# EAGLE design TIA sep amp 7 March (EAGLE 6.6.0)
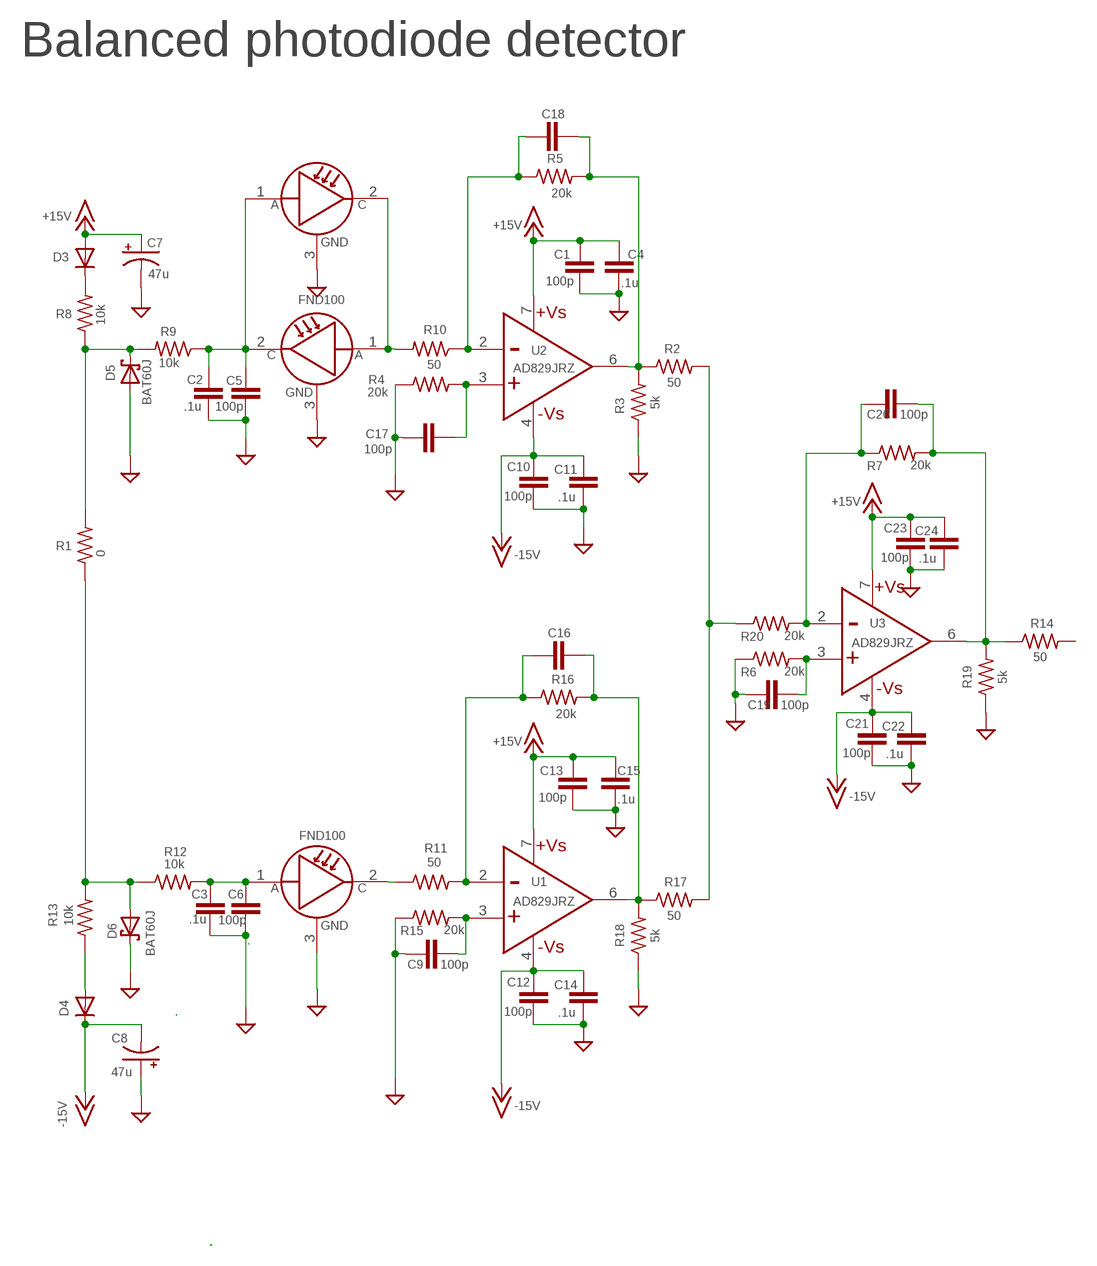
[diagram p0: schematic, sheet 1]

## Parts
C1  100p  C-EUC0603  [C0603]
C2  .1u  C-EUC0603  [C0603]
C3  .1u  C-EUC0603  [C0603]
C4  .1u  C-EUC0603  [C0603]
C5  100p  C-EUC0603  [C0603]
C6  100p  C-EUC0603  [C0603]
C7  47u  CPOL-USETR3  [ETR3]
C8  47u  CPOL-USETR3  [ETR3]
C9  100p  C-EUC0603  [C0603]
C10  100p  C-EUC0603  [C0603]
C11  .1u  C-EUC0603  [C0603]
C12  100p  C-EUC0603  [C0603]
C13  100p  C-EUC0603  [C0603]
C14  .1u  C-EUC0603  [C0603]
C15  .1u  C-EUC0603  [C0603]
C16  C-EUC0603  [C0603]
C17  100p  C-EUC0603  [C0603]
C18  C-EUC0603  [C0603]
C19  100p  C-EUC0603  [C0603]
C20  100p  C-EUC0603  [C0603]
C21  100p  C-EUC0603  [C0603]
C22  .1u  C-EUC0603  [C0603]
C23  100p  C-EUC0603  [C0603]
C24  .1u  C-EUC0603  [C0603]
D3  SOD523DIODE  [SOD523]
D4  SOD523DIODE  [SOD523]
D5  BAT60J  [SOD323_ST]
D6  BAT60J  [SOD323_ST]
R1  0  R-US_R0603  [R0603]
R2  50  R-US_R0603  [R0603]
R3  5k  R-US_R0603  [R0603]
R4  20k  R-US_R0603  [R0603]
R5  20k  R-US_R0603  [R0603]
R6  20k  R-US_R0603  [R0603]
R7  20k  R-US_R0603  [R0603]
R8  10k  R-US_R0603  [R0603]
R9  10k  R-US_R0603  [R0603]
R10  50  R-US_R0603  [R0603]
R11  50  R-US_R0603  [R0603]
R12  10k  R-US_R0603  [R0603]
R13  10k  R-US_R0603  [R0603]
R14  50  R-US_R0603  [R0603]
R15  20k  R-US_R0603  [R0603]
R16  20k  R-US_R0603  [R0603]
R17  50  R-US_R0603  [R0603]
R18  5k  R-US_R0603  [R0603]
R19  5k  R-US_R0603  [R0603]
R20  20k  R-US_R0603  [R0603]
U1  AD829JRZ  [SOIC127P600X175-8N]
U2  AD829JRZ  [SOIC127P600X175-8N]
U3  AD829JRZ  [SOIC127P600X175-8N]
U$1  FND100  [TO254P939X470-3P]
U$2  FND100  [TO254P939X470-3P]
U$4  FND100  [TO254P939X470-3P]

## Nets
+15V: C1.2 C4.2 C7.+ C13.2 C15.2 C23.2 C24.2 D3.A U1.7(+VS) U2.7(+VS) U3.7(+VS)
-15V: C8.- C10.2 C11.2 C12.2 C14.2 C21.2 C22.2 D4.C U1.4(-VS) U2.4(-VS) U3.4(-VS)
GND: C1.1 C2.1 C3.1 C4.1 C5.1 C6.1 C7.- C8.+ C9.1 C10.1 C11.1 C12.1 C13.1 C14.1 C15.1 C17.1 C19.1 C21.1 C22.1 C23.1 C24.1 D5.A D6.C R3.1 R4.1 R6.1 R15.1 R18.1 R19.1 U$1.3(GND) U$2.3(GND) U$4.3(GND)
N$1: D3.C R8.2
N$2: C16.1 R11.2 R16.1 U1.2(-IN)
N$3: C16.2 R16.2 R17.1 R18.2 U1.6(OUTPUT)
N$4: C17.2 R4.2 U2.3(+IN)
N$5: C2.2 C5.2 R9.1 U$1.2(C) U$4.1(A)
N$7: C18.1 R5.1 R10.1 U2.2(-IN)
N$8: D5.C R1.2 R8.1 R9.2
N$9: R10.2 U$1.1(A) U$4.2(C)
N$10: R11.1 U$2.2(C)
N$11: C3.2 C6.2 R12.2 U$2.1(A)
N$12: D6.A R1.1 R12.1 R13.2
N$13: D4.A R13.1
N$15: R2.2 R17.2 R20.1
N$16: C18.2 R2.1 R3.2 R5.2 U2.6(OUTPUT)
N$18: C9.2 R15.2 U1.3(+IN)
N$20: C19.2 R6.2 U3.3(+IN)
N$21: C20.2 R7.2 R14.1 R19.2 U3.6(OUTPUT)
N$24: C20.1 R7.1 R20.2 U3.2(-IN)
Unconnected: R14.2

## Notes on the sheet
- Balanced photodiode detector
- FND100
- FND100

## Library data of the parts
C1-C6 C9-C24 = rcl:C-EU: CAPACITOR, European symbol
C7 C8 = rcl:CPOL-US: POLARIZED CAPACITOR, American symbol
D3 D4 = mylibrary:SOD523DIODE
D5 D6 = diode:BAT60J: Schottky barrier diode Source: www.st.com, BAT60J.pdf
R1-R20 = rcl:R-US_: RESISTOR, American symbol
U1-U3 = mylibrary:AD829JRZ: High Speed, Low Noise Video Op Amp; MPN: AD829JRZ; OC_FARNELL: 1651321; OC_NEWARK: 19M8894; PACKAGE: SOIC-8; SUPPLIER: Analog Devices
U$1 U$2 U$4 = mylibrary:FND100

## Board
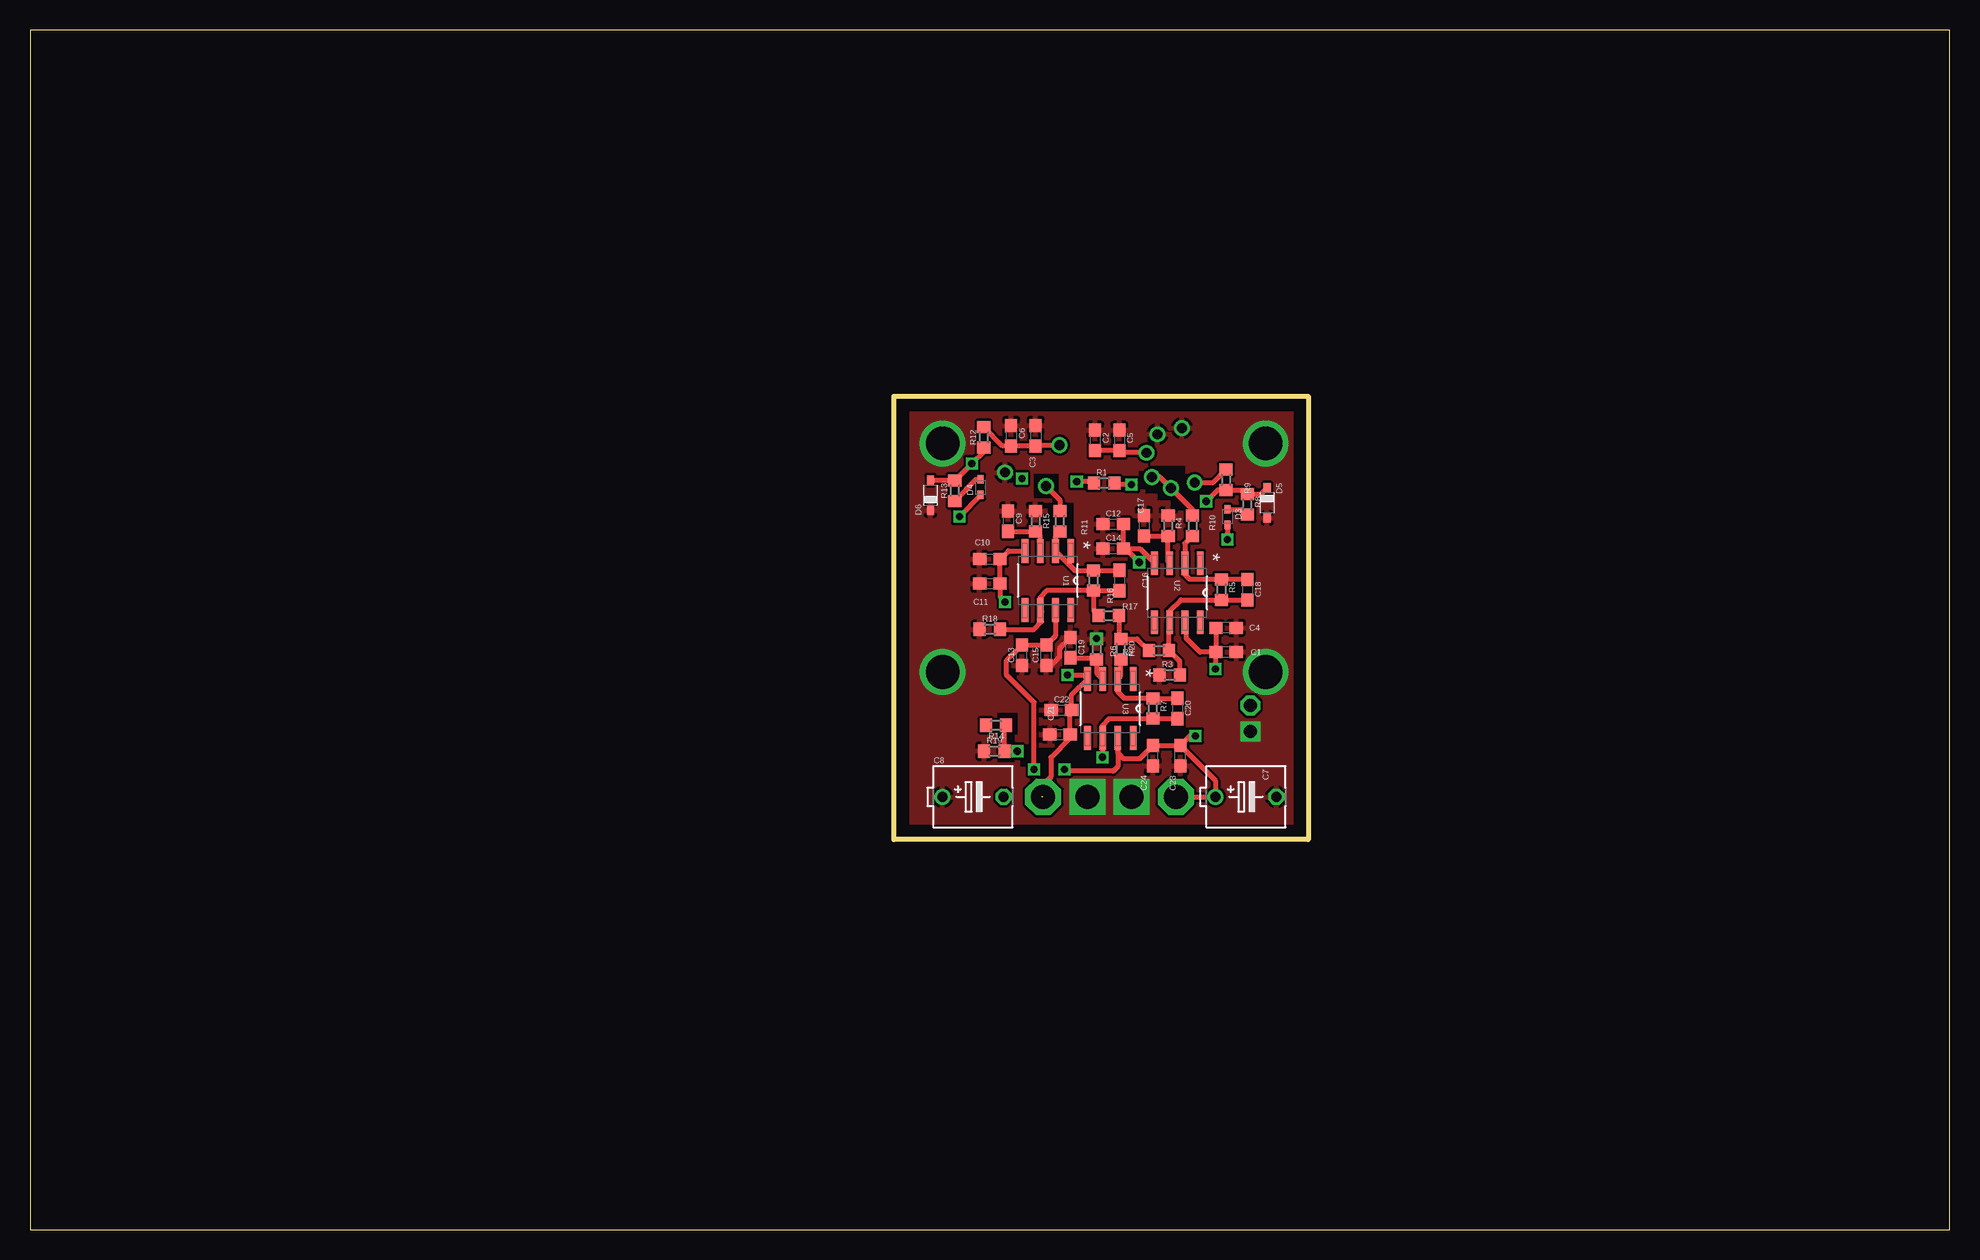
[diagram p1: board, top side]
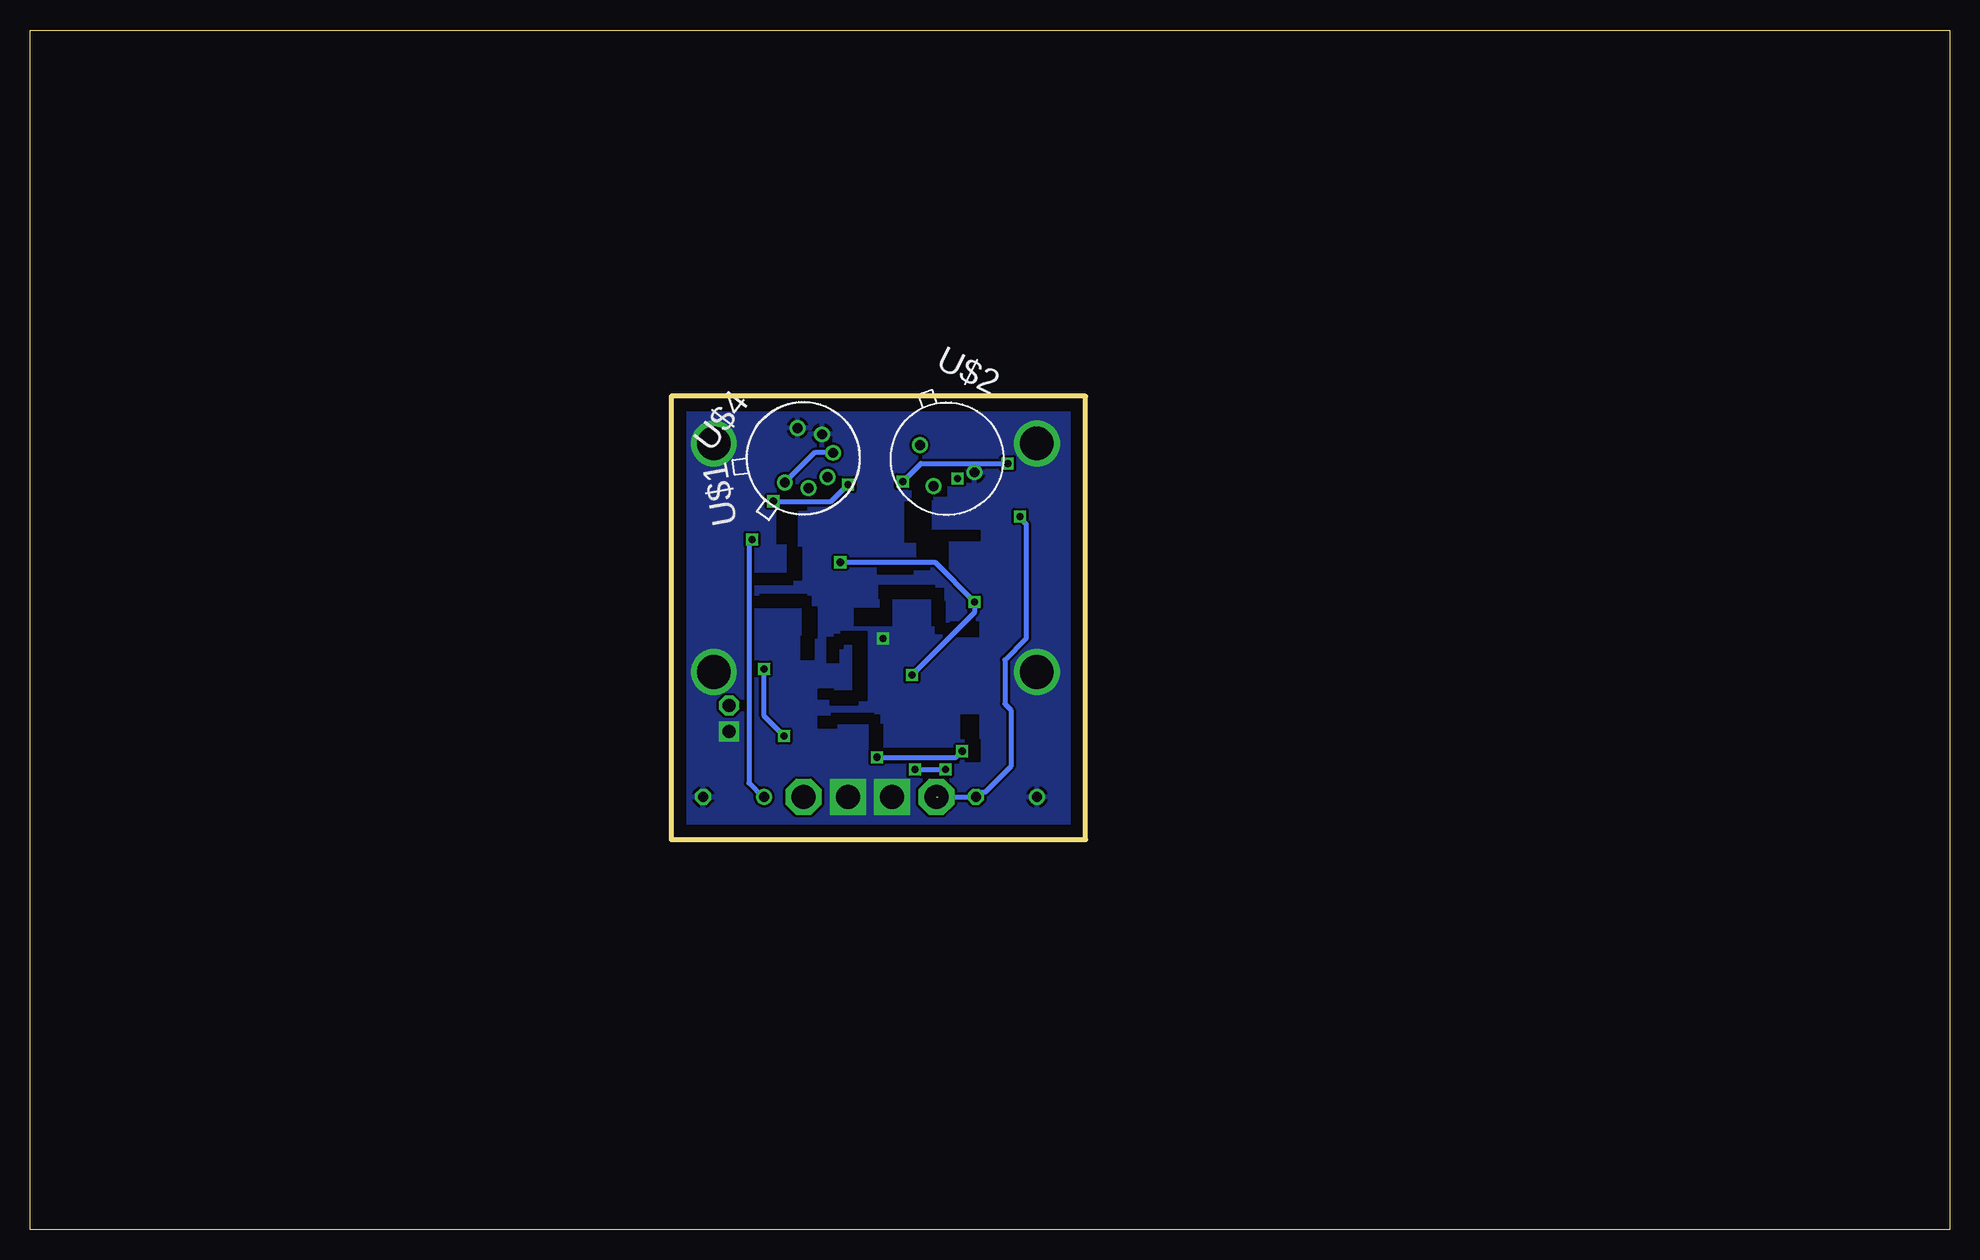
[diagram p2: board, bottom side, seen from below]

Size 160 x 100 mm. Coordinates in mm from the lower left corner, seen from the top.
Outline: 0,0 160,0 160,100 0,100 0,0
Outline: 72.01,69.47 106.55,69.47 106.55,32.51 72.01,32.51 72.01,69.47
Copper layers (1*16): Top 0.035mm / dielectric 1.5mm / Bottom 0.035mm
Design rules "default": minimum track width 10mil, minimum drill 24mil, track to track 8mil, track to pad 8mil, pad to pad 8mil, via to via 8mil, smd to smd 8mil, copper to edge 40mil, drill to drill 8mil, minimum pad ring 10mil, minimum via ring 8mil, stop-mask expansion 4mil, vias tented up to drill 0mil, thermal gap 10mil
tRestrict: area 83.7,61 to 85.7,63; area 94,60.8 to 96.4,62; area 93.2,61.8 to 96.3,63.6; area 92.5,61.7 to 94.1,63.2; area 95.1,59.9 to 96.5,60.8; area 93,61.3 to 94.2,62.1; area 84.8,57.4 to 87,60.6; area 82.6,38.6 to 90,40.1; area 81,39.2 to 82.2,40.6; area 80.6,39 to 82,40.9; area 80.6,40.8 to 82,43.1; area 81.4,41.3 to 82.3,43.1
bRestrict: area 95.6,54.1 to 96.9,56.9; area 96.4,54 to 99.8,54.7; area 96.4,53.7 to 99.8,54.2; area 85,55 to 86.1,58.3; area 85.2,57.4 to 86.6,58.4; area 83.4,55.2 to 84.7,58.2; area 80.8,57.4 to 84.7,58.3; area 85.1,58.4 to 86.7,61; area 84.7,60.8 to 86.5,61.6; area 83.6,61.1 to 84.8,62.6; area 94.4,49.3 to 95.6,51.9; area 94.9,51.8 to 99.7,52.8; 29 more areas

### Footprints (pad centres in the part's own frame; a part is rotated, then mirrored left to right if it is on the bottom)
C0603 = smd 1.1 x 1: 1 -0.85,0; 2 0.85,0
ETR3 = drill 0.813: + -2.54,0 | drill 0.813 octagon: - 2.54,0
SOD523 = smd 0.7 x 0.5: A 0.7,0; C -0.6,0
SOD323_ST = smd 0.8 x 0.6: A 1.25,0; C -1.25,0
R0603 = smd 1 x 1.1: 1 -0.85,0; 2 0.85,0
SOIC127P600X175-8N = smd 1.981 x 0.559: 1 -2.464,1.905; 2 -2.464,0.635; 3 -2.464,-0.635; 4 -2.464,-1.905; 5 2.464,-1.905; 6 2.464,-0.635; 7 2.464,0.635; 8 2.464,1.905
TO254P939X470-3P = drill 0.813: 1 -5.08,0; 2 -2.54,-2.54; 3 0,0

### Placement (x,y rotation side)
C1  99.69,48.13 180 top
C2  88.77,65.79 270 top
C3  83.82,66.17 270 top
C4  99.69,50.16 180 top
C5  90.81,65.79 270 top
C6  81.79,66.17 270 top
C7  101.35,36.07 0 top
C8  78.61,36.07 0 top
C9  81.53,59.05 270 top
C10  80.01,55.88 0 top
C11  80.01,53.85 0 top
C12  90.3,58.8 0 top
C13  82.68,47.88 90 top
C14  90.3,56.77 0 top
C15  84.71,47.88 90 top
C16  90.81,54.1 270 top
C17  92.84,58.67 270 top
C18  101.47,53.34 270 top
C19  86.74,48.51 270 top
C20  95.63,43.43 270 top
C21  85.85,41.27 0 top
C22  85.98,43.31 0 top
C23  95.89,39.5 90 top
C24  93.6,39.5 90 top
D3  99.82,59.44 270 top
D4  79.25,61.85 90 top
D5  103.12,60.58 270 top
D6  75.06,61.21 90 top
R1  89.53,62.23 0 top
R2  94.11,48.26 180 top
R3  95,46.23 0 top
R4  94.87,58.67 270 top
R5  99.31,53.34 270 top
R6  88.9,48.39 270 top
R7  93.6,43.43 270 top
R8  101.47,60.45 270 top
R9  99.69,62.48 270 top
R10  96.9,58.67 90 top
R11  85.85,59.05 270 top
R12  79.5,66.04 90 top
R13  77.09,61.59 90 top
R14  80.52,42.04 180 top
R15  83.82,59.05 270 top
R16  88.65,54.1 270 top
R17  89.92,51.18 0 top
R18  80.01,50.04 0 top
R19  80.39,39.88 0 top
R20  90.93,48.39 270 top
U1  84.84,54.1 270 top
U2  95.63,53.09 270 top
U3  90.04,43.43 270 top
U$1  96.01,66.8 100.2 bottom
U$2  81.28,63.12 333.4 bottom
U$4  93.98,66.29 52.3 bottom

### Tracks (layer width: path | path; a pad name or v marks a point on that pad's centre or on a via)
+15V  (via drill 0.6, 2)
  Top 0.406: v95.5,36.07 C7.+ 98.81,37.43 C23.2 | C23.2 C24.2 92.5,39.24 91.19,39.24 90.68,39.75 U3.7 90.68,38.61 90.3,38.23 86.36,38.23 v86.23,38.35 | C4.2 C1.2 | C1.2 97.54,48.13 96.39,49.28 96.39,50.49 U2.7 | C23.2 96.69,41.15 v97.16,41.15 | v98.81,46.74 98.84,46.77 C1.2 | D3.A v99.82,57.53 | U1.7 85.47,49.49 C15.2 C13.2 81.41,47.46 81.41,46.23 83.69,43.94 v83.69,38.35
  Bottom 0.406: v97.16,41.15 98.81,42.8 v98.81,46.74 | v86.23,38.35 v83.69,38.35 | v99.82,57.53 100.08,57.28 100.08,37.21 98.93,36.07 C7.+
-15V  (via drill 0.6)  (1 unrouted)
  Top 0.406: C14.2 C12.2 | U1.4 81.55,56.57 C10.2 C11.2 80.86,52.74 v81.28,52.32 | 84.33,36.07 84.33,36.96 85.09,37.72 85.09,39.37 86.7,40.98 C21.2 86.7,43.18 C22.2 86.83,44.59 U3.4 87.81,46.23 v86.49,46.23 | C14.2 92.51,56.77 U2.4 | C14.2 91.31,56.77 v92.46,55.63 | D4.C 79.25,61.21 v77.47,59.44
  Bottom 0.406: 84.45,36.07 C8.- 80.77,36.45 80.39,36.45 78.23,38.61 78.23,43.31 78.74,43.81 78.74,47.5 76.96,49.28 76.96,58.8 77.47,59.31 v77.47,59.44 | v86.49,46.23 81.28,51.44 v81.28,52.32 84.58,55.63 v92.46,55.63
GND  (via drill 0.6, 1.1, 2 pad 1.68, 2.8 pad 1.68)
  Top 0.406: C15.1 85.13,47.03 85.85,47.75 85.85,48.48 C19.1
  other vias: 76.07,65.53 103,65.53 76.07,46.48 103,46.48 88.14,36.07 91.82,36.07 88.9,49.28 101.73,41.53
  pour Top: 73.41,68.33 105.16,68.33 105.16,33.78 73.41,33.78
  pour Bottom: 73.41,68.33 105.16,68.33 105.16,33.78 73.41,33.78
N$1
  Top 0.406: D3.C 101.04,60.04 R8.2
N$2
  Top 0.406: R11.2 85.47,57.7 U1.2 87.08,54.95 R16.1 C16.1
N$3
  Top 0.406: R16.2 C16.2 | R16.2 84.75,53.25 84.2,52.7 U1.6 84.33,51.51 84.33,50.67 83.69,50.04 R18.2 | R16.2 88.65,51.6 R17.1
N$4
  Top 0.406: C17.2 R4.2 94.87,55.68 U2.3
N$5
  Top 0.406: C2.2 C5.2 90.99,64.75 U$1.2 | U$4.1 98.64,62.27 R9.1
  Bottom 0.406: U$1.2 94.61,64.75 U$4.1
N$6  (via drill 2)
  other vias: 84.45,36.07
N$7
  Top 0.406: R10.1 96.27,57.19 U2.2 96.27,54.61 96.69,54.19 R5.1 C18.1
N$8  (via drill 0.6)
  Top 0.406: D5.C 102.6,61.3 R8.1 101.14,61.63 R9.2 98.97,61.63 v98.04,60.71 | v91.82,62.1 90.51,62.1 R1.2
  Bottom 0.406: v98.04,60.71 93.22,60.71 v91.82,62.1
N$9
  Top 0.406: R10.2 96.9,60.01 U$1.1 94.18,62.73 U$4.2
N$10
  Top 0.406: U$2.2 85.85,60.82 R11.1
N$11
  Top 0.406: U$2.1 83.9,65.39 C3.2 C6.2 81.08,65.32 R12.2
N$12  (via drill 0.6)
  Top 0.406: D6.A 77.09,62.46 R13.2 v78.5,63.86 78.57,63.92 79.5,64.86 R12.1 | R1.1 88.56,62.36 v87.25,62.36
  Bottom 0.406: v87.25,62.36 85.75,63.86 v78.5,63.86
N$13
  Top 0.406: R13.1 78.89,62.55 D4.A
N$15
  Top 0.406: R2.2 92.28,49.24 R20.1 90.77,49.4 R17.2
N$16
  Top 0.406: C18.2 R5.2 95.92,52.49 95,51.56 U2.6 94.96,50.58 R2.1 95.85,47.37 R3.2
N$17  (via drill 0.6)
  other vias: 82.68,62.61
N$18
  Top 0.406: U1.3 84.2,57.82 R15.2 C9.2
N$19  (via drill 1.1)
  other vias: 101.73,43.69
N$20
  Top 0.406: C19.2 88.77,47.66 R6.2 88.9,46.41 U3.3
N$21  (via drill 0.6)
  Top 0.406: C20.2 R7.2 89.95,42.58 89.41,42.04 U3.6 v89.41,39.37 | R14.1 81.24,41.91 R19.2 v82.3,39.88
  Bottom 0.406: v89.41,39.37 82.8,39.37 v82.3,39.88
N$24
  Top 0.406: C20.1 R7.1 91.22,44.28 90.68,44.83 U3.2 90.93,46.15 R20.2